# Altium schematic sheet XP_Driver.SchDoc
size A4
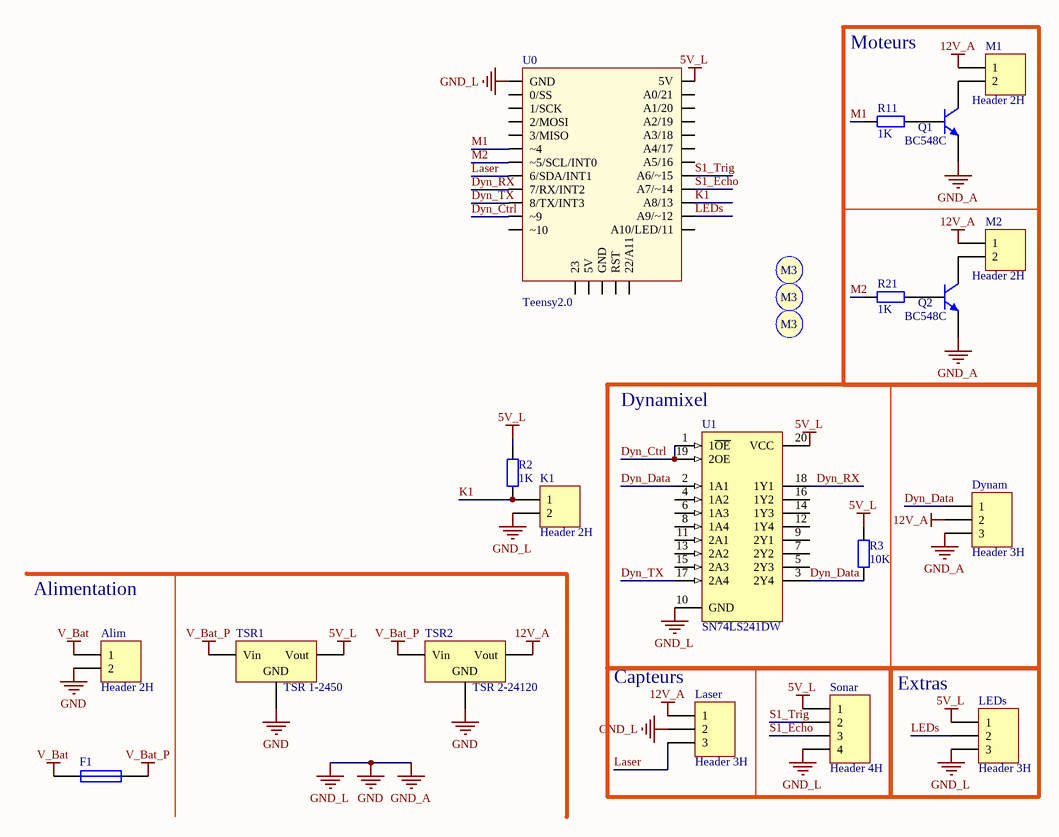
[diagram p0: XP_Driver.SchDoc]

## Parts
Alim  Header 2H  [Molex_MiniFitJr_2x1H]
Dynam  Header 3H  [Molex SPOX 3x1H]
F1  Fuse 1  [Fuse]  (value not drawn)
K1  Header 2H  [Molex SPOX 2x1H]
Laser  Header 3H  [MOLEX KK254 3X1H M]
LEDs  Header 3H  [Molex SPOX 3x1H]
M1  Header 2H  [Molex SPOX 2x1H]
M2  Header 2H  [Molex SPOX 2x1H]
Q1  BC548C  [TO-92A]
Q2  BC548C  [TO-92A]
R2  value 1K  [3.2X1.6X1.1]  (hidden comment: Res2)
R3  value 10K  [3.2X1.6X1.1]  (hidden comment: Res2)
R11  value 1K  [3.2X1.6X1.1]  (hidden comment: Res2)
R21  value 1K  [3.2X1.6X1.1]  (hidden comment: Res2)
S1  Screw M3  [Screw M3]  (value not drawn)
S3  Screw M3  [Screw M3]  (value not drawn)
S4  Screw M3  [Screw M3]  (value not drawn)
Sonar  Header 4H  [Molex SPOX 4x1H]
TSR1  TSR 1-2450  [TRS]
TSR2  TSR 2-24120  [TRS - centered]
U0  Teensy2.0  [Teensy2.0]
U1  SN74LS241DW  [DW020_N]

## Blocks framed on the sheet
Moteurs: M1 M2 Q1 Q2 R11 R21
Dynamixel: Dynam R3 U1
Capteurs: Laser Sonar

## Nets
5V_L: LEDs.1 R2.1 R3.2 Sonar.1 TSR1.3(Vout) U0.29(5V) U1.20(VCC)
12V_A: Dynam.2 Laser.1 M1.1 M2.1 TSR2.3(Vout)
GND: Alim.2 Dynam.3 K1.2 Laser.2 LEDs.3 Q1.1(E) Q2.1(E) Sonar.4 TSR1.2(GND) TSR2.2(GND) U0.1(GND) U1.10(GND)  [also labelled GND_A, GND_L]
V_Bat: Alim.1 F1.1
V_Bat_P: F1.2 TSR1.1(Vin) TSR2.1(Vin)
Dyn_Ctrl: U0.11(~9) U1.1(1~{OE}) U1.19(2OE)
Dyn_Data: Dynam.1 R3.1 U1.2(1A1) U1.3(2Y4)
Dyn_RX: U0.9(7/RX/INT2) U1.18(1Y1)
Dyn_TX: U0.10(8/TX/INT3) U1.17(2A4)
K1: K1.1 R2.2 U0.20(A8/13)
Laser: Laser.3 U0.8(6/SDA/INT1)
LEDs: LEDs.2 U0.19(A9/~12)
M1: R11.1 U0.6(~4)
M2: R21.1 U0.7(~5/SCL/INT0)
S1_Echo: Sonar.3 U0.21(A7/~14)
S1_Trig: Sonar.2 U0.22(A6/~15)
NetM1_2: M1.2 Q1.3(C)
NetM2_2: M2.2 Q2.3(C)
NetQ1_2: Q1.2(B) R11.2
NetQ2_2: Q2.2(B) R21.2

Not connected (* = marked no-connect by the designer): U0 2(0/SS) 3(1/SCK) 4(2/MOSI) 5(3/MISO) 12(~10) 13(23) 14(5V) 15(GND) 16(RST) 17(22/A11) 18(A10/LED/11) 23(A5/16) 24(A4/17) 25(A3/18) 26(A2/19) 27(A1/20) 28(A0/21); U1 4(1A2) 5(2Y3) 6(1A3) 7(2Y2) 8(1A4) 9(2Y1) 11(2A1) 12(1Y4) 13(2A2) 14(1Y3) 15(2A3) 16(1Y2)

## Notes on the sheet
- Alimentation
- (near LEDs) Extras
- (in symbol Screw M3) M3

## Library data of the parts
Alim K1 = Header 2H: Header, 2-Pin, Right Angle; LatestRevisionDate: 17-Jul-2002; LatestRevisionNote: Re-released for DXP Platform.; Publisher: Altium Limited
Dynam Laser LEDs = Header 3H: Header, 3-Pin, Right Angle; LatestRevisionDate: 17-Jul-2002; LatestRevisionNote: Re-released for DXP Platform.; Publisher: Altium Limited
F1 = Fuse 1: Fuse; Published: 8-Jun-2000; LatestRevisionDate: 17-Jul-2002; LatestRevisionNote: Re-released for DXP Platform.; PackageReference: PIN-W2/E2.8; Publisher: Altium Limited; PackageDescription: Thru-Hole; 2 Leads
M1 M2 = Header 2H: Header, 2-Pin, Right Angle; pin to pad: 1>2 2>1; LatestRevisionDate: 17-Jul-2002; LatestRevisionNote: Re-released for DXP Platform.; Publisher: Altium Limited
Q1 Q2 = 2N3904: NPN General Purpose Amplifier; Published: 8-Jun-2000; LatestRevisionDate: 15-Jan-2003; LatestRevisionNote: PCB Footprint 'BCY-W3/D4.7' replaced; DatasheetVersion: 1997; PackageVersion: Sep-1998; PackageReference: TO-92A; Publisher: Altium Limited; PackageDescription: TO, Flat Index; 3 In-Line, Axial Leads; Body Dia. 4.5mm; Leads 0.51 x 0.48 mm (max); ComponentLink1Description: Manufacturer Link; ComponentLink1URL: http://www.fairchildsemi.com/; ComponentLink2Description: Datasheet; ComponentLink2URL: http://www.fairchildsemi.com/ds/2N%2F2N3904.pdf
R2 R3 R11 R21 = Res2: Resistor; Published: 8-Jun-2000; LatestRevisionDate: 17-Jul-2002; LatestRevisionNote: Re-released for DXP Platform.; PackageReference: AXIAL-0.4; Publisher: Altium Limited; PackageDescription: Axial Device, Thru-Hole; 2 Leads; 0.4 in Pin Spacing
Sonar = Header 4H: Header, 4-Pin, Right Angle; LatestRevisionDate: 17-Jul-2002; LatestRevisionNote: Re-released for DXP Platform.; Publisher: Altium Limited
TSR1 TSR2 = Volt Reg: Voltage Regulator; Published: 24-Mar-1999; LatestRevisionDate: 29-May-2009; LatestRevisionNote: IPC-7351 Footprint Added.; PackageReference: D2PAK; Publisher: Altium Limited; PackageDescription: 3-Pin Transistor Outline Package 2.54 mm Pitch, 15.1 mm Lead Span
U0 = Teensy2.0: Teensy 2.0 with minimal pinout
U1 = SN74LS241DW: Octal Buffer and Line Driver with 3-State Outputs; ComponentAvailability: Obsolete; Published: 8-Jun-2000; LatestRevisionDate: 13-Apr-2006; LatestRevisionNote: IPC-7351 Footprint Added.; DatasheetVersion: Mar-1988; PackageVersion: Mar-2000; PackageReference: DW020; Publisher: Altium Limited; PackageDescription: 20-Pin Plastic Small Outline Integrated Circuit 1.27 mm Pitch; Code_JEDEC: MS-013; Code_IPC: SOIC127P1030-20; ComponentLink1Description: Manufacturer Link; ComponentLink1URL: http://www.ti.com/; ComponentLink2Description: Datasheet; ComponentLink2URL: http://www-s.ti.com/sc/ds/sn74ls240.pdf